# Altium schematic sheet BMS.SchDoc
size A; SheetNumber: 4; SheetTotal: 4
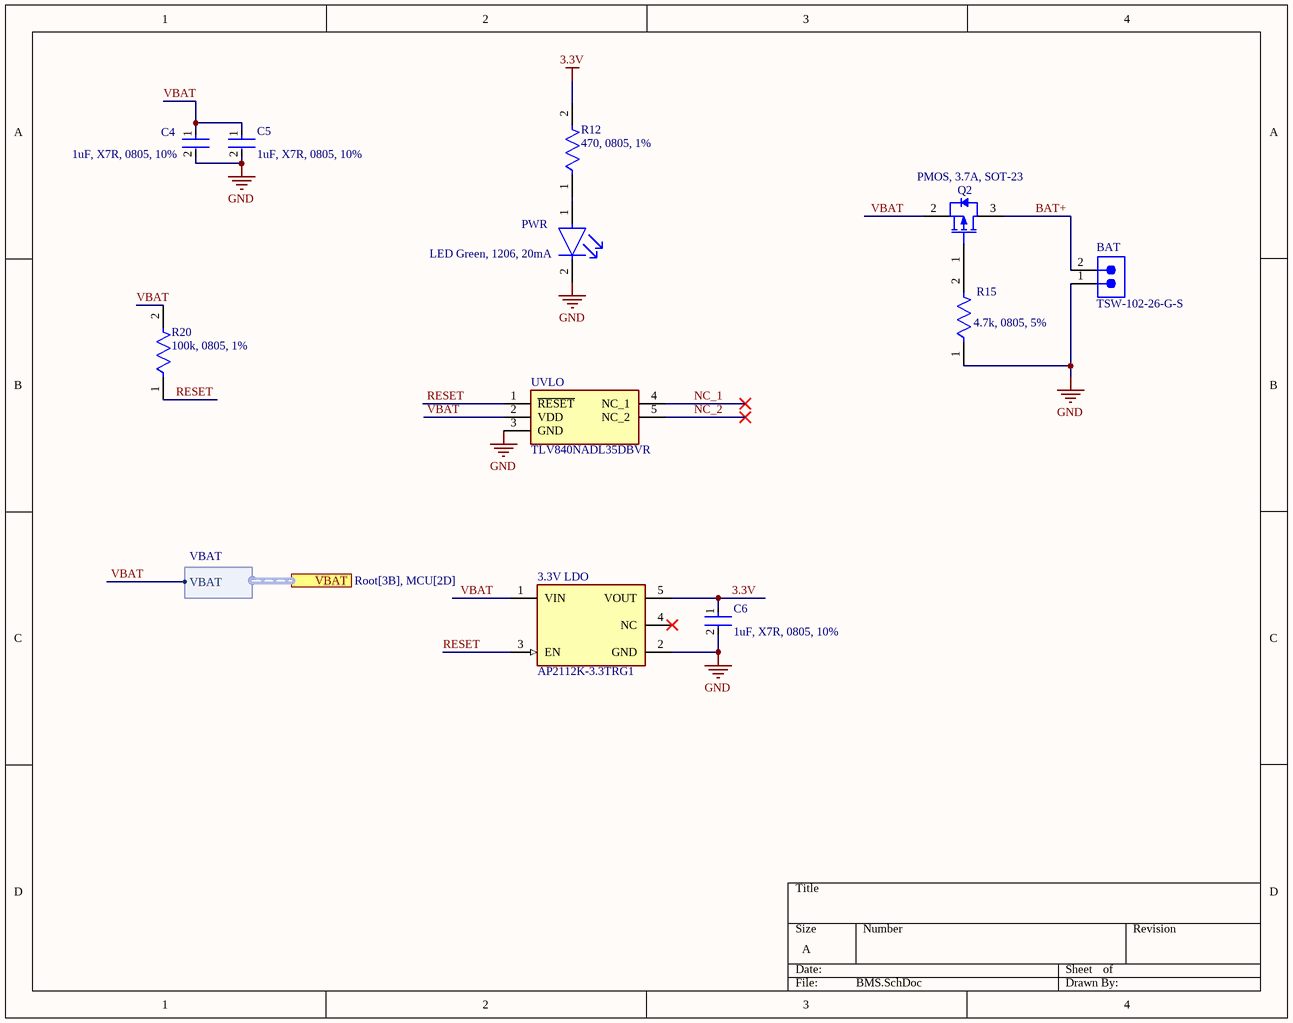
[diagram p0: BMS.SchDoc]

## Parts
3.3V_LDO  AP2112K-3.3TRG1  [FP-SOT25-IPC_A]
BAT  TSW-102-26-G-S  [SMTC-TSW-102-26-XX-S]
C4  1uF, X7R, 0805, 10%  [FP-CC0805-0_85-MFG]
C5  1uF, X7R, 0805, 10%  [FP-CC0805-0_85-MFG]
C6  1uF, X7R, 0805, 10%  [FP-CC0805-0_85-MFG]
PWR  LED Green, 1206, 20mA  [FP-SML-LX1206GC-TR-MFG]
Q2  PMOS, 3.7A, SOT-23  [ONSC-SOT-23-3-318-08_V]
R12  470, 0805, 1%  [FP-RMCF0805-IPC_C]
R15  4.7k, 0805, 5%  [FP-RMCF0805-MFG]
R20  100k, 0805, 1%  [FP-CRGCQ0805-IPC_C]
UVLO  TLV840NADL35DBVR  [SOT95P280X145-5N]

## Ports
VBAT (harness VBAT, see Root[3B], MCU[2D])

## Harnesses
VBAT: VBAT

## Nets
3.3V: 3.3V_LDO.5(VOUT) C6.1 R12.2
GND: 3.3V_LDO.2(GND) BAT.1 C4.2 C5.2 C6.2 PWR.2(C) R15.1 UVLO.3(GND)
BAT+: BAT.2 Q2.3(D)
NC_1: UVLO.4(NC_1)
NC_2: UVLO.5(NC_2)
RESET: 3.3V_LDO.3(EN) R20.1 UVLO.1(~{RESET})
VBAT: 3.3V_LDO.1(VIN) C4.1 C5.1 Q2.2(S) R20.2 UVLO.2(VDD) ; port VBAT.VBAT
NetPWR_1: PWR.1(A) R12.1
NetQ2_1: Q2.1(G) R15.2

Not connected (* = marked no-connect by the designer): 3.3V_LDO 4(NC)*

## Library data of the parts
3.3V_LDO = CMP-12756-000035-1: IC REG LINEAR 3.3V 600MA SOT25; Number of Regulators: 1; Output Type: Fixed; Polarity: Positive; Min Input Voltage: 2.5V; Max Input Voltage: 6V; Accuracy: 1.5%; Quiescent Current: 55uA; Dropout Voltage: 250mV; Min Operating Temperature: -40°C; Length: 3.1mm; Output Current: 600mA; Max Operating Temperature: 85°C; Package Quantity: 1; Output Voltage: 3.3V; Width: 1.7mm; Number of Outputs: 1; Packaging: Tape and Reel; Height: 1.3mm; Lead Free: Lead Free; Max Output Current: 600mA; Case/Package: SOT-23-5; Mount: Surface Mount; Number of Pins: 5
BAT = CMP-1024-00327-1: 0.025" SQ Post Header, Through-hole, Vertical, -55 to 125 degC, 2.54 mm Pitch, 2-Pin, Male, RoHS; Manufacturer: Samtec; Pitch: 2.54 mm; Orientation: Vertical; ComponentLink3Description: Package Specification; PackageReference: TSW-102-26-XX-S; Mounting Technology: Through-hole; ComponentLink2Description: Datasheet; ComponentLink1URL: http://www.samtec.com; DatasheetVersion: F-214; ComponentLink1Description: Manufacturer URL; RoHS: True; ComponentLink2URL: http://www.samtec.com/documents/webfiles/pdf/TSW_TH.PDF; PartNumber: TSW-102-26-G-S; ComponentLink3URL: http://www.samtec.com/documents/webfiles/cpdf/TSW-XXX-XX-XXX-X-XX-XXX-MKT.pdf; PackageDescription: .025[0.64] SQ. Post Terminal Strip Assembly; PackageVersion: DM, 8/1988; Temperature Range: -55 to 125 degC
C4-C6 = CMP-03422-001015-1: CC0805 1 uF X7R 10.00% 50 V; Manufacturer Part Number: CC0805KFX7R9BB105; Manufacturer: Yageo; Material: Ceramic; Tolerance: 0.1; Voltage Rating: 50 V; Device Class L1: Passive Components; Ipc Land Pattern Name: CAPC200125X85; Temperature Range High: +85°C; ComponentLink2Description: Datasheet; Automotive: No; Temperature Range Low: -30°C; Height: 0.95mm; Device Class L2: Capacitors; Value: 1 uF; Octopart: https://octopart.com/cc0805kfx7r9bb105-yageo-76378930; Temperature Characteristic: X7R; Category: Cap; RoHS: TRUE; ComponentLink2URL: http://www.yageo.com/documents/recent/UPY-GPHC_Y5V_6.3V-to-50V_8.pdf; Package: CC0805-0.85; Footprint Url: http://www.yageo.com/exep/pages/download/literatures/UPY-C_GEN_24.pdf; Capacitance: 1 uF; Temperature: -30°C to +85°C; Lead Free: Yes; Mouser Description: Cap Ceramic 1uF 50VDC X7R 10% SMD 0805 125°C BP; Device Class L3: Ceramic Capacitors
PWR = CMP-2000-07122-2: LED GREEN CLEAR 1206 SMD; Luminous Intensity: 10mcd; Forward Voltage: 2.2V; Viewing Angle: 160°; Lens Color: Colorless; Approvals: UL; Dominant Wavelength: 565nm; Current Rating: 25mA; Number of LEDs: 1; Power Rating: 65mW; Lens Style: Rectangular; Test Current: 20mA; Length: 3.2mm; Mount: Surface Mount; Package Quantity: 1; Forward Current: 20mA; Case/Package: 1206; Lead Free: Lead Free; Case Code (Imperial): 1206; Max Operating Temperature: 85°C; REACH SVHC: No SVHC; RoHS Compliant: Yes; Number of Pins: 2; Illumination Color: Green; Width: 1.6mm; Packaging: Tape and Reel; Wavelength: 565nm; Lens Transparency: Clear; Height: 1.1mm; Color: Green; Min Operating Temperature: -40°C; Case Code (Metric): 3216
Q2 = CMP-1058-00758-1: Small Signal MOSFET, -8 V, -3.7 A, Single P-Channel, 3-Pin SOT-23, Pb-Free, Tape and Reel; Manufacturer: On Semiconductor; PartNumber: NTR2101PT1G; Crss Typ (pF): 218; V(BR)DSS Min (V): 8; VGS(th) Max (V): 1; ID Max (A): 3.7; PD Max (W): 0.96; Ciss Typ (pF): 1173; Channel Polarity: P Channel; Coss Typ (pF): 289; DatasheetVersion: Rev. 6; ComponentLink3URL: http://www.onsemi.cn/pub_link/Collateral/318-08.PDF; Mounting Technology: Surface Mount; RoHS: Pb-Free; Configuration: Single; PackageVersion: Rev. AP, 11/2009; VGS Max (V): 8; PackageReference: SOT-23-3-318-08; Package Type: SOT-23-3; ComponentLink2URL: http://www.onsemi.cn/pub_link/Collateral/NTR2101P-D.PDF; ComponentLink2Description: Datasheet; PackageDescription: 3-Pin Small Outline Transistor, Body 2.92 x 1.3 mm, Pitch 0.95 mm; ComponentLink3Description: Package Specification; ComponentLink1Description: Manufacturer URL; ComponentLink1URL: http://www.onsemi.com/; Packing: Tape and Reel
R12 = CMP-26527-003746-1: 470Ω ±1% 0.125W 0805 Thick Film Chip Resistor AEC-Q200 compliant; Resistance: 470R; Temperature Coefficient: 100ppm/°C; Max Power Dissipation: 125mW; Resistor Type: Thick Film; Number of Terminations: 2; Packaging: Tape and Reel; RoHS Compliant: Yes; Case/Package: 0805; Mount: Surface Mount; Contact Plating: Tin; Series: RMCF; Min Operating Temperature: -55°C; Radiation Hardening: No; Features: Automotive AEC-Q200; Tolerance: 1%; Max Operating Temperature: 155°C
R15 = CMP-26527-004085-1: 4.7kΩ ±5% 0.125W 0805 Thick Film Chip Resistor AEC-Q200 compliant; Temperature Coefficient: 200ppm/°C; Max Power Dissipation: 125mW; Resistance: 4.7kR; RoHS Compliant: Yes; Package Quantity: 10000; Packaging: Tape and Reel; Contact Plating: Tin; Radiation Hardening: No; Mount: Surface Mount; Height: 0.026inch; Case Code (Metric): 2012; Tolerance: 5%; Case/Package: 0805; Width: 0.049inch; Series: RMCF; Case Code (Imperial): 0805; Number of Terminations: 2; Min Operating Temperature: -55°C; Resistor Type: Thick Film; Max Operating Temperature: 155°C; Length: 0.079inch; Features: Automotive AEC-Q200
R20 = CMP-03211-000816-1: CRGCQ 0805 100K 1%; Manufacturer: TE Connectivity; Manufacturer Part Number: CRGCQ0805F100K; Tolerance: 0.01; Power Rating: 0.125W; Resistance: 100KΩ; Value: 100KΩ; Temperature Coefficient: ±100ppm/°C; Voltage Rating: 150V; RoHS: TRUE; ComponentLink2URL: https://www.te.com/commerce/DocumentDelivery/DDEController?Action=showdoc&DocId=Data+Sheet%7F1773204-3%7F1%7Fpdf%7FEnglish%7FENG_DS_1773204-3_1.pdf%7F4-2176341-1150; Category: Res; Device Class L2: Resistors; Height: 0.65mm; Ambient Temperature Range High: +70°C; Ipc Land Pattern Name: RESC200125X55; Octopart: https://octopart.com/crgcq0805f100k-te+connectivity-91018138; Digikey Description: CRGCQ 0805 100K 1%; Temperature Range High: +155°C; Lead Free: Yes; Automotive: Yes; Temperature Range Low: -55°C; Device Class L1: Passive Components; Device Class L3: Chip SMD Resistors; Mouser Description: Res Thick Film 0805 100K Ohm 1% 0.125W(1/8W) ±100ppm/C Pad SMD Automotive T/R; Temperature: -55°C to +155°C; Composition: Thick Film; ComponentLink2Description: Datasheet; Automotive Grade: Grade 1141; Package: CRGCQ0805; Series: CRGCQ
UVLO = TLV840NADL35DBVR: Integrated Circuit; Manufacturer_Name: Texas Instruments; Datasheet Link: https://www.ti.com/lit/gpn/TLV840; Height: 1.45mm; Manufacturer_Part_Number: TLV840NADL35DBVR; Mouser Part Number: 595-TLV840NADL35DBVR; Mouser Price/Stock: https://www.mouser.co.uk/ProductDetail/Texas-Instruments/TLV840NADL35DBVR?qs=DPoM0jnrROXoabpTxCy%2FVQ%3D%3D; Arrow Part Number: TLV840NADL35DBVR; Arrow Price/Stock: https://www.arrow.com/en/products/tlv840nadl35dbvr/texas-instruments?region=nac